# Altium project TPS5450DDAR.PrjPcb
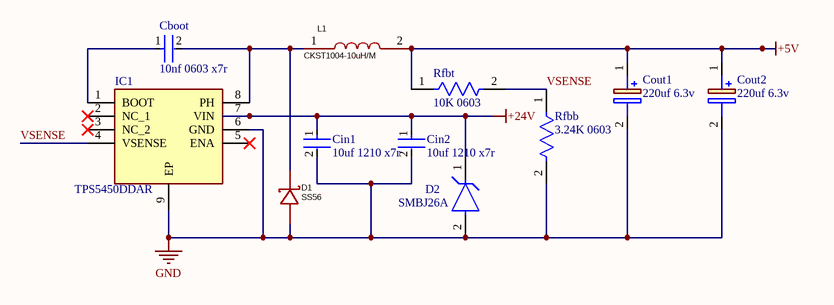
[diagram p0: Sheet1.SchDoc]
1 sheet, 11 parts. Net scope: global (net labels, ports and power ports of the same name join across sheets).
Board file: PCB1.PcbDoc

## Sheet Sheet1.SchDoc
size A4; SheetNumber: 1; SheetTotal: 1

### Parts
Cboot  10nf 0603 x7r  [FP-C0603C-CF-MFG]
Cin1  10uf 1210 x7r  [FP-C1210C106K5RACTU-MFG]
Cin2  10uf 1210 x7r  [FP-C1210C106K5RACTU-MFG]
Cout1  220uf 6.3v  [CAPPM3528X210N]
Cout2  220uf 6.3v  [CAPPM3528X210N]
D1  SS56  [SMC_L7.1-W6.2-LS8.1-R-RD]
D2  SMBJ26A  [FP-SMBJ-MFG]
IC1  TPS5450DDAR  [SOIC127P600X170-9N]
L1  (no value)  [IND-SMD_L11.6-W10.1]
Rfbb  3.24K 0603  [FP-RT0603-MFG]
Rfbt  10K 0603  [FP-RC0603-0_55-IPC_C]

### Nets
+5V: Cout1.1(+) Cout2.1(+) L1.2 Rfbt.1
+24V: Cin1.1 Cin2.1 D2.1(C) IC1.7(VIN)
GND: Cin1.2 Cin2.2 Cout1.2(-) Cout2.2(-) D1.1(A) D2.2(A) IC1.6(GND) IC1.9(EP) Rfbb.2
VSENSE: IC1.4(VSENSE) Rfbb.1 Rfbt.2
NetCboot_1: Cboot.1 IC1.1(BOOT)
NetCboot_2: Cboot.2 D1.2(K) IC1.8(PH) L1.1

Not connected (* = marked no-connect by the designer): IC1 2(NC_1)* 3(NC_2)* 5(ENA)*

### Library data of the parts
Cboot = CMP-2006-03712-2: CAP CER 10000PF 50V X7R 0603; Manufacturer Part Number: C0603C103K5RACAUTO; Manufacturer: KEMET; Automotive Grade: Grade 1; Tolerance: 0.1; Temperature Coefficient: 30ppm/°C; Value: 10,000 pF; Description: C0603 10,000 pF X7R 30ppm/°C 10.00% 50 V; RoHS: TRUE; Automotive: Yes; Device Class L2: Capacitors; ComponentLink2Description: Datasheet; Device Class L3: Ceramic Capacitors; Digikey Description: CAP CER 10000PF 50V X7R 0603; Temperature Characteristic: X7R; Temperature: -55°C to +125°C; Temperature Range High: +125°C; Octopart: https://octopart.com/c0603c103k5racauto-kemet-12563692; Lead Free: Yes; Material: Ceramic; Mouser Description: Multilayer Ceramic Capacitors MLCC - SMD/SMT .01UF 50V 10% 0603 AUTO; Temperature Range Low: -55°C; Height: 0.87mm; ComponentLink2URL: https://api.kemet.com/component-edge/download/datasheet/C0603C100J5GACAUTO.pdf; Capacitance: 10,000 pF; Device Class L1: Passive Components; Category: Cap; Package: C0603C-CF; Voltage Rating: 50 V
Cin1 Cin2 = CMP-2000-07565-2: CAP CER 10UF 50V X7R 1210; Dielectric Material: Ceramic; Tolerance: 10%; Min Operating Temperature: -55°C; Length: 3.2mm; Dielectric: X7R; Max Operating Temperature: 125°C; REACH SVHC: No SVHC; Mount: Surface Mount; Voltage Rating: 50V; Voltage: 50V; Package Quantity: 1000; Case Code (Imperial): 1210; Voltage Rating (DC): 50V; Termination: SMD/SMT; Case/Package: 1210; Packaging: Tape and Reel; Height: 2.5mm; Width: 2.5mm; Depth: 2.5mm; Capacitance: 10uF; Weight: 0.000564oz; Case Code (Metric): 3225; RoHS Compliant: Yes; Thickness: 0.11inch
Cout1 Cout2 = TLJB227M006R0500: Capacitor Polarised; Manufacturer_Name: Kyocera AVX; Datasheet Link: https://www.mouser.fr/datasheet/2/40/TLJ-3169755.pdf; Height: 2.1mm; Manufacturer_Part_Number: TLJB227M006R0500; Mouser Part Number: 581-TLJB227M006R0500; Mouser Price/Stock: https://www.mouser.co.uk/ProductDetail/AVX/TLJB227M006R0500?qs=o28%2FEEzBmj050XjtnkgQxA%3D%3D; Arrow Part Number: TLJB227M006R0500; Arrow Price/Stock: https://www.arrow.com/en/products/tljb227m006r0500/avx?region=nac
D1 = SS56C_C24138: Manufacturer: MDD(辰达半导体); Manufacturer Part: SS56C; Symbol: SS56 SMC; Add into BOM: yes; Diode Configuration: 独立式; Forward Voltage (Vf@If): 700mV@5A; Reverse Voltage (Vr): 60V; Rectified Current: 5A; Reverse Leakage Current (Ir): 1mA@60V; Device: SS56C_C24138; LCSC Part Name: 电压:60V 电流:5A; Supplier Part: C24138; Supplier Footprint: SMC(DO-214AB); JLCPCB Part Class: Extended Part; Datasheet: https://atta.szlcsc.com/upload/public/pdf/source/20240809/85001FE6B8209D29868878B4C087FFCD.pdf; Supplier: LCSC; Convert to PCB: yes
D2 = CMP-08607-000063-1: TVS DIODE 26V 42.1V DO214AA; Manufacturer: Littelfuse; Breakdown Voltage: 28.9V; Description: 42.1V Clamp 14.3A Ipp Tvs Diode Surface Mount DO-214AA (SMBJ); Peak Pulse Power: 600W; Peak Pulse Current: 14.3A; Direction: Unidirectional; Number Of Channels: 1; Max Junction Temp: +150°C; Lead Free: Yes; Device Class L1: Circuit Protection; Height: 2.61mm; Device Class L3: unset; Reverse Standoff Voltage: 26V; ComponentLink2URL: https://www.littelfuse.com/~/media/electronics/datasheets/tvs_diodes/littelfuse_tvs_diode_smbj_datasheet.pdf.pdf; Automotive: No; Octopart: https://octopart.com/smbj26a-littelfuse-350771; Device Class L2: TVS Diodes; Clamping Voltage: 42.1V; Manufacturer Part Number: SMBJ26A; Temperature Range High: +150°C; Category: Diode; RoHS: TRUE; Temperature: -65°C to +150°C; Mouser Description: TVS Diodes - Transient Voltage Suppressors 26Vr 600W 14.3A 5% UniDirectional; Package: SMBJ; Digikey Description: TVS DIODE 26V 42.1V DO214AA; Temperature Range Low: -65°C; ComponentLink2Description: Datasheet
IC1 = TPS5450DDAR: Integrated Circuit; Manufacturer_Name: Texas Instruments; Datasheet Link: http://www.ti.com/general/docs/suppproductinfo.tsp?distId=10&gotoUrl=http%3A%2F%2Fwww.ti.com%2Flit%2Fgpn%2Ftps5450; Height: 1.7mm; Manufacturer_Part_Number: TPS5450DDAR; Mouser Part Number: 595-TPS5450DDAR; Mouser Price/Stock: https://www.mouser.co.uk/ProductDetail/Texas-Instruments/TPS5450DDAR?qs=h%2FYsCRHtaqPaz8oWBdcCug%3D%3D; Arrow Part Number: TPS5450DDAR; Arrow Price/Stock: https://www.arrow.com/en/products/tps5450ddar/texas-instruments?region=nac
L1 = CKST1004-10uH/M: Manufacturer: CENKER(岑科); Add into BOM: yes; Tolerance: ±20%; Rated Current: 6.5A; Saturation Current (Isat): 7A; DC Resistance (DCR): 30mΩ; Type: 一体成型电感; Symbol: CKST1004-10UH/M; Device: CKST1004-10uH/M; LCSC Part Name: 10uH ±20% 7A; Supplier Part: C3002686; Manufacturer Part: CKST1004-10uH/M; Supplier Footprint: SMD,10.1x11.6mm; JLCPCB Part Class: Extended Part; Datasheet: https://atta.szlcsc.com/upload/public/pdf/source/20220510/B48FE89972EB9627500571FF6CB43AFA.pdf; Supplier: LCSC; Convert to PCB: yes; CKST1004-10uH/M: CKST1004-10uH/M
Rfbb = CMP-03412-003421-1: RES SMD 3.24K OHM 0.1% 1/10W; Manufacturer Part Number: RT0603BRD073K24L; Manufacturer: Yageo; Tolerance: 0.001; Voltage Rating: 75V; Temperature Coefficient: 25 ppm/°C; Description: RT0603 3.24KΩ 0.1W 25 ppm/°C 0.10%; Power Rating: 0.1W; Value: 3.24KΩ; Lead Free: Yes; Mouser Description: Thin Film Resistors - SMD 1/10W 3.24K ohm .1% 25ppm; Height: 0.55mm; Ipc Land Pattern Name: RESC16080X45; Temperature: -55°C to +155°C; Digikey Description: RES SMD 3.24K OHM 0.1% 1/10W; Device Class L1: Passive Components; Device Class L3: Chip SMD Resistors; Temperature Range Low: -55°C; ComponentLink2Description: Datasheet; Category: Res; Automotive: No; Composition: Thin Film; Series: RT; Octopart: https://octopart.com/rt0603brd073k24l-yageo-1278728; Footprint Url: http://www.yageo.com/exep/pages/download/literatures/PYu-R_Mount_10.pdf; Temperature Range High: +155°C; Device Class L2: Resistors; ComponentLink2URL: http://www.yageo.com/documents/recent/PYu-RT_1-to-0.01_RoHS_L_9.pdf; RoHS: TRUE; Resistance: 3.24KΩ; Package: RT0603
Rfbt = CMP-2100-03664-2: RES 10K OHM 1% 1/10W 0603; Voltage Rating: 75V; Voltage Rating (DC): 50V; Resistance: 10kR; Power Rating: 100mW; Temperature Coefficient: 100ppm/°C; Depth: 0.8mm; Termination: SMD/SMT; Resistor Type: Thick Film; Series: RC; Construction: Rectangular; Features: Moisture Resistant; Packaging: Tape and Reel; Min Operating Temperature: -55°C; Number of Terminations: 2; Lead Pitch: 0.3mm; RoHS Compliant: Yes; Case/Package: 0603; Resistance Tolerance: 1%; Military Standard: Not; Weight: 7.1E-05oz; Number of Pins: 2; Tolerance: 1%; Length: 1.6mm; Case Code (Imperial): 0603; Lead Free: Lead Free; Width: 0.8mm; Max Power Dissipation: 100mW; Height: 0.45mm; Max Operating Temperature: 155°C; Case Code (Metric): 1608; Size Code: 0603